# EAGLE design MFOS_VCO_edge (EAGLE 7.6.0)
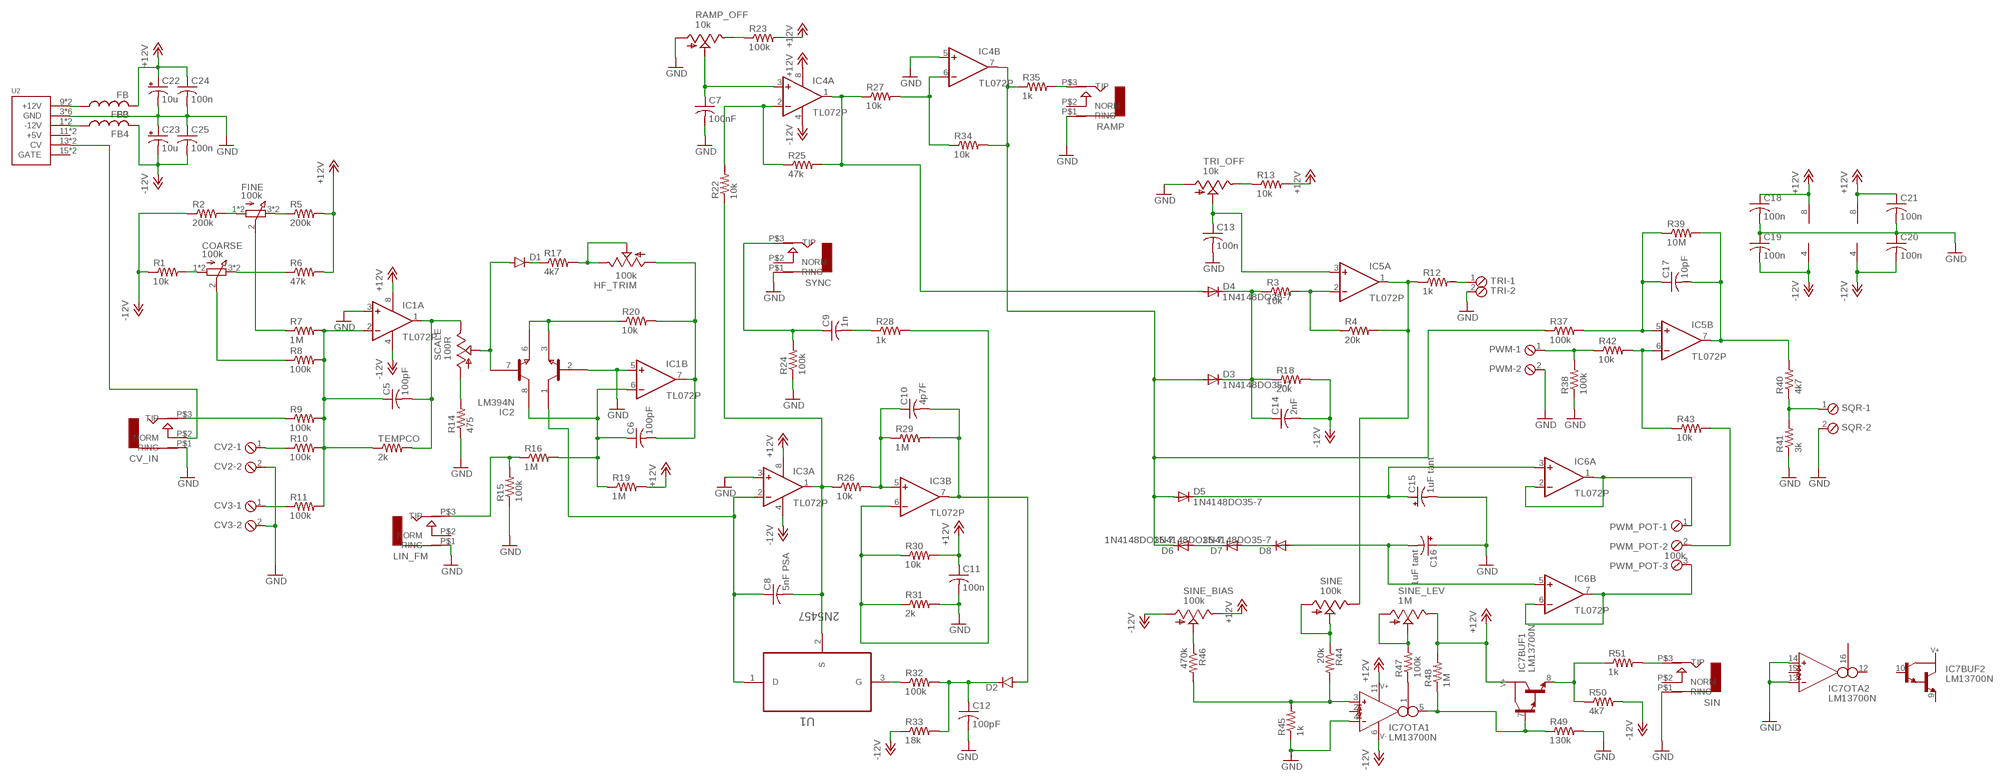
[diagram p0: schematic, sheet 1]

## Parts
C5  100pF  C-US050-024X044  [C050-024X044]
C6  100pF  C-US050-024X044  [C050-024X044]
C7  100nF  C-US050-024X044  [C050-024X044]
C8  5nF PSA  C-US050-024X044  [C050-024X044]
C9  1n  C-US050-024X044  [C050-024X044]
C10  4p7F  C-US050-024X044  [C050-024X044]
C11  100n  C-US050-024X044  [C050-024X044]
C12  100pF  C-US050-024X044  [C050-024X044]
C13  100n  C-US050-030X075  [C050-030X075]
C14  2nF  C-US050-030X075  [C050-030X075]
C15  1uF tant  CPOL-USB45181A  [B45181A]
C16  1uF tant  CPOL-USB45181A  [B45181A]
C17  10pF  C-US050-024X044  [C050-024X044]
C18  100n  C-USC1206  [C1206]
C19  100n  C-USC1206  [C1206]
C20  100n  C-USC1206  [C1206]
C21  100n  C-USC1206  [C1206]
C22  10u  CPOL-USB45181A  [B45181A]
C23  10u  CPOL-USB45181A  [B45181A]
C24  100n  C-US050-024X044  [C050-024X044]
C25  100n  C-US050-024X044  [C050-024X044]
COARSE  100k  3RP/1610N  [3RP/1610N]
CV2  MPT2  [2POL254]
CV3  MPT2  [2POL254]
CV_IN  AUDIO-JACKITEAD  [JACK-90DEG-ITEAD]
D1  DIODE1N4148  [DIODE-1N4148]
D2  DIODE1N4148  [DIODE-1N4148]
D3  1N4148DO35-7  [DO35-7]
D4  1N4148DO35-7  [DO35-7]
D5  1N4148DO35-7  [DO35-7]
D6  1N4148DO35-7  [DO35-7]
D7  1N4148DO35-7  [DO35-7]
D8  1N4148DO35-7  [DO35-7]
FB3  FB  [FB]
FB4  FB  [FB]
FINE  100k  3RP/1610N  [3RP/1610N]
HF_TRIM  100k  TRIM_US-B64W  [B64W]
IC1  TL072P  [DIL08]
IC2  LM394N  [DIL08]
IC3  TL072P  [DIL08]
IC4  TL072P  [DIL08]
IC5  TL072P  [DIL08]
IC6  TL072P  [DIL08]
IC7  LM13700N  [DIL16]
LIN_FM  AUDIO-JACKITEAD  [JACK-90DEG-ITEAD]
PWM  MPT2  [2POL254]
PWM_POT  100k  MPT3  [3POL254]
R1  10k  R-US_0207/7  [0207/7]
R2  200k  R-US_0207/7  [0207/7]
R3  10k  R-US_0207/7  [0207/7]
R4  20k  R-US_0207/7  [0207/7]
R5  200k  R-US_0207/7  [0207/7]
R6  47k  R-US_0207/7  [0207/7]
R7  1M  R-US_0207/7  [0207/7]
R8  100k  R-US_0207/7  [0207/7]
R9  100k  R-US_0207/7  [0207/7]
R10  100k  R-US_0207/7  [0207/7]
R11  100k  R-US_0207/7  [0207/7]
R12  1k  R-US_0207/7  [0207/7]
R13  10k  R-US_0207/7  [0207/7]
R14  475  R-US_0207/7  [0207/7]
R15  100k  R-US_0207/7  [0207/7]
R16  1M  R-US_0207/7  [0207/7]
R17  4k7  R-US_0207/7  [0207/7]
R18  20k  R-US_0207/7  [0207/7]
R19  1M  R-US_0207/7  [0207/7]
R20  10k  R-US_0207/7  [0207/7]
R22  10k  R-US_0207/7  [0207/7]
R23  100k  R-US_0207/7  [0207/7]
R24  100k  R-US_0207/7  [0207/7]
R25  47k  R-US_0207/7  [0207/7]
R26  10k  R-US_0207/7  [0207/7]
R27  10k  R-US_0207/7  [0207/7]
R28  1k  R-US_0207/7  [0207/7]
R29  1M  R-US_0207/7  [0207/7]
R30  10k  R-US_0207/7  [0207/7]
R31  2k  R-US_0207/7  [0207/7]
R32  100k  R-US_0207/7  [0207/7]
R33  18k  R-US_0207/7  [0207/7]
R34  10k  R-US_0207/7  [0207/7]
R35  1k  R-US_0207/7  [0207/7]
R37  100k  R-US_0207/7  [0207/7]
R38  100k  R-US_0207/7  [0207/7]
R39  10M  R-US_0207/7  [0207/7]
R40  4k7  R-US_0207/7  [0207/7]
R41  3k  R-US_0207/7  [0207/7]
R42  10k  R-US_0207/7  [0207/7]
R43  10k  R-US_0207/7  [0207/7]
R44  20k  R-US_0207/7  [0207/7]
R45  1k  R-US_0207/7  [0207/7]
R46  470k  R-US_0207/7  [0207/7]
R47  100k  R-US_0207/7  [0207/7]
R48  1M  R-US_0207/7  [0207/7]
R49  130k  R-US_0207/7  [0207/7]
R50  4k7  R-US_0207/7  [0207/7]
R51  1k  R-US_0207/7  [0207/7]
RAMP  AUDIO-JACKITEAD  [JACK-90DEG-ITEAD]
RAMP_OFF  10k  TRIM_US-B64W  [B64W]
SCALE  100R  TRIM_US-B64W  [B64W]
SIN  AUDIO-JACKITEAD  [JACK-90DEG-ITEAD]
SINE  100k  TRIM_US-B64W  [B64W]
SINE_BIAS  100k  TRIM_US-B64W  [B64W]
SINE_LEV  1M  TRIM_US-B64W  [B64W]
SQR  MPT2  [2POL254]
SYNC  AUDIO-JACKITEAD  [JACK-90DEG-ITEAD]
TEMPCO  2k  R-US_0207/2V  [0207/2V]
TRI  MPT2  [2POL254]
TRI_OFF  10k  TRIM_US-B64W  [B64W]
U1  2N5457  [TO127P254X732-3]
U2  POWER  [POWER_16]

## Nets
+12V: C11.1 C18.1 C21.1 C22.+ C24.1 FB3.P$2 IC1.8(P:V+) IC3.8(P:V+) IC4.8(P:V+) IC5.8(P:V+) IC6.8(P:V+) IC7.11(SUPPLY:V+) R5.2 R6.2 R13.2 R19.2 R23.2 R30.2 R48.2 SINE_BIAS.E SINE_LEV.E
-12V: C14.2 C19.2 C20.2 C23.- C25.2 FB4.P$2 IC1.4(P:V-) IC3.4(P:V-) IC4.4(P:V-) IC5.4(P:V-) IC6.4(P:V-) IC7.6(SUPPLY:V-) R1.1 R2.1 R18.2 R33.1 R50.2 SINE_BIAS.A
GND: C7.2 C11.2 C12.2 C13.2 C15.- C16.+ C18.2 C19.1 C20.1 C21.2 C22.- C23.+ C24.2 C25.1 CV2.2 CV3.2 CV_IN.P$1(RING) IC1.3(A:+IN) IC1.5(B:+IN) IC2.2(B1) IC3.3(A:+IN) IC4.5(B:+IN) IC7.4(OTA1:IN_N) IC7.13(OTA2:IN_N) IC7.14(OTA2:IN_P) LIN_FM.P$1(RING) PWM.2 R14.1 R15.1 R24.1 R31.2 R38.1 R41.1 R45.1 R49.2 RAMP.P$1(RING) RAMP_OFF.A SIN.P$1(RING) SQR.2 SYNC.P$1(RING) TRI.2 TRI_OFF.A U2.3(GND) U2.4(GND) U2.5(GND) U2.6(GND) U2.7(GND) U2.8(GND)
N$1: COARSE.1(A) COARSE.4(A) R1.2
N$2: FINE.1(A) FINE.4(A) R2.2
N$3: FINE.3(E) FINE.6(E) R5.1
N$4: COARSE.3(E) COARSE.6(E) R6.1
N$5: FINE.2(S) R7.1
N$6: COARSE.2(S) R8.1
N$7: R14.2 SCALE.A
N$8: D1.A IC2.7(B2) SCALE.P$1(S) SCALE.S
N$9: C5.2 IC1.1(A:OUT) SCALE.E TEMPCO.2
N$10: C5.1 IC1.2(A:-IN) R7.2 R8.2 R9.2 R10.2 R11.2 TEMPCO.1
N$12: IC2.3(E1) IC2.6(E2) R20.1
N$13: CV_IN.P$2(NORM) U2.13(CV) U2.14(CV)
N$14: HF_TRIM.E HF_TRIM.P$1(S) HF_TRIM.S R17.2
N$15: D1.C R17.1
N$16: C6.2 HF_TRIM.A IC1.7(B:OUT) R20.2
N$17: CV_IN.P$3(TIP) R9.1
N$18: CV2.1 R10.1
N$19: CV3.1 R11.1
N$20: LIN_FM.P$3(TIP) R15.2 R16.1
N$21: C8.2 IC3.1(A:OUT) R22.1 R26.1 U1.2(S)
N$22: C10.1 IC3.5(B:+IN) R26.2 R29.1
N$23: C8.1 IC2.1(C1) IC3.2(A:-IN) U1.1(D)
N$24: C9.2 R28.1
N$25: C9.1 R24.2 SYNC.P$3(TIP)
N$26: IC3.6(B:-IN) R28.2 R30.1 R31.1
N$27: R23.1 RAMP_OFF.E
N$28: C7.1 IC4.3(A:+IN) RAMP_OFF.P$1(S) RAMP_OFF.S
N$29: R32.1 U1.3(G)
N$30: C10.2 D2.A IC3.7(B:OUT) R29.2
N$31: IC4.2(A:-IN) R22.2 R25.1
N$32: C12.1 D2.C R32.2 R33.2
N$33: D4.A IC4.1(A:OUT) R25.2 R27.1
N$34: IC4.6(B:-IN) R27.2 R34.1
N$35: D3.A D5.A D6.C IC4.7(B:OUT) R34.2 R35.1 R37.1
N$36: R35.2 RAMP.P$3(TIP)
N$40: C6.1 IC1.6(B:-IN) IC2.8(C2) R16.2 R19.1
N$41: FB3.P$1 U2.9(+12V) U2.10(+12V)
N$42: D6.A D7.C
N$43: D7.A D8.C
N$44: C14.1 D3.C D4.C R3.1 R18.1
N$45: IC5.2(A:-IN) R3.2 R4.1
N$46: IC5.1(A:OUT) R4.2 R12.1 SINE.E
N$47: R12.2 TRI.1
N$48: R13.1 TRI_OFF.E
N$49: C13.1 IC5.3(A:+IN) TRI_OFF.P$1(S) TRI_OFF.S
N$50: C16.- D8.A IC6.5(B:+IN)
N$51: C15.+ D5.C IC6.3(A:+IN)
N$52: IC6.1(A:OUT) IC6.2(A:-IN) PWM_POT.1
N$53: IC6.6(B:-IN) IC6.7(B:OUT) PWM_POT.3
N$54: PWM.1 R38.2 R42.1
N$55: C17.1 IC5.5(B:+IN) R37.2 R39.1
N$56: C17.2 IC5.7(B:OUT) R39.2 R40.2
N$57: R40.1 R41.2 SQR.1
N$58: IC5.6(B:-IN) R42.2 R43.1
N$59: PWM_POT.2 R43.2
N$60: R44.1 SINE.A SINE.P$1(S) SINE.S
N$61: IC7.3(OTA1:IN_P) R44.2 R45.2 R46.2
N$62: R46.1 SINE_BIAS.P$1(S) SINE_BIAS.S
N$63: IC7.1(OTA1:I_BIAS) R47.1
N$64: R47.2 SINE_LEV.A SINE_LEV.P$1(S) SINE_LEV.S
N$65: IC7.5(OTA1:OUT) IC7.7(BUF1:B) R48.1 R49.1
N$66: R51.2 SIN.P$3(TIP)
N$67: IC7.8(BUF1:E) R50.1 R51.1
N$68: FB4.P$1 U2.1(-12V) U2.2(-12V)
Unconnected: IC7.2(OTA1:I_DIODE) IC7.9(BUF2:E) IC7.10(BUF2:B) IC7.12(OTA2:OUT) IC7.15(OTA2:I_DIODE) IC7.16(OTA2:I_BIAS) LIN_FM.P$2(NORM) RAMP.P$2(NORM) SIN.P$2(NORM) SYNC.P$2(NORM) U2.11(+5V) U2.12(+5V) U2.15(GATE) U2.16(GATE)

## Library data of the parts
C5-C14 C17-C21 C24 C25 = rcl:C-US: CAPACITOR, American symbol
C15 C16 C22 C23 = rcl:CPOL-US: POLARIZED CAPACITOR, American symbol
COARSE FINE = pot:3RP/1610N: 16mm Potentiometer one level Source: http://www.alphapotentiometers.net/html/16mm_pot_2.html
CV2 CV3 PWM SQR TRI = con-phoenix-254:MPT2: PHOENIX CONNECTOR; OC_FARNELL: unknown; OC_NEWARK: unknown
CV_IN LIN_FM RAMP SIN SYNC = erthenvar:AUDIO-JACK: Switching Mono 3.5mm Audio Jack from Erthenvar.
D1 D2 = SparkFun-DiscreteSemi:DIODE: Diode These are standard reverse protection diodes and small signal diodes. SMA package can handle up to about 1A. SOD-323 can handle about 200mA. What the SOD-323 package when ordering, there are some mfgs out there that are 5-pin packages.
D3-D8 = diode:1N4148: DIODE high speed (Philips)
FB3 FB4 = adafruit:FB: Ferrite bead Digikey #P9821BK-ND
HF_TRIM RAMP_OFF SCALE SINE SINE_BIAS SINE_LEV TRI_OFF = pot:TRIM_US-: POTENTIOMETER
IC1 IC3-IC6 = linear:TL072: OP AMP
IC2 = synthdiy:LM394: National Dual TRANSISTOR
IC7 = ota:LM13700: Dual OTA with buffers
PWM_POT = con-phoenix-254:MPT3: PHOENIX CONNECTOR; OC_FARNELL: unknown; OC_NEWARK: unknown
R1-R20 R22-R35 R37-R51 TEMPCO = rcl:R-US_: RESISTOR, American symbol
U1 = Fairchild_By_element14_Batch_1:2N5457: Transistor; MPN: 2N5457; OC_FARNELL: 1653694; OC_NEWARK: 58K2809; PACKAGE: TO-92; SUPPLIER: Fairchild
U2 = eurorack:POWER

## Board
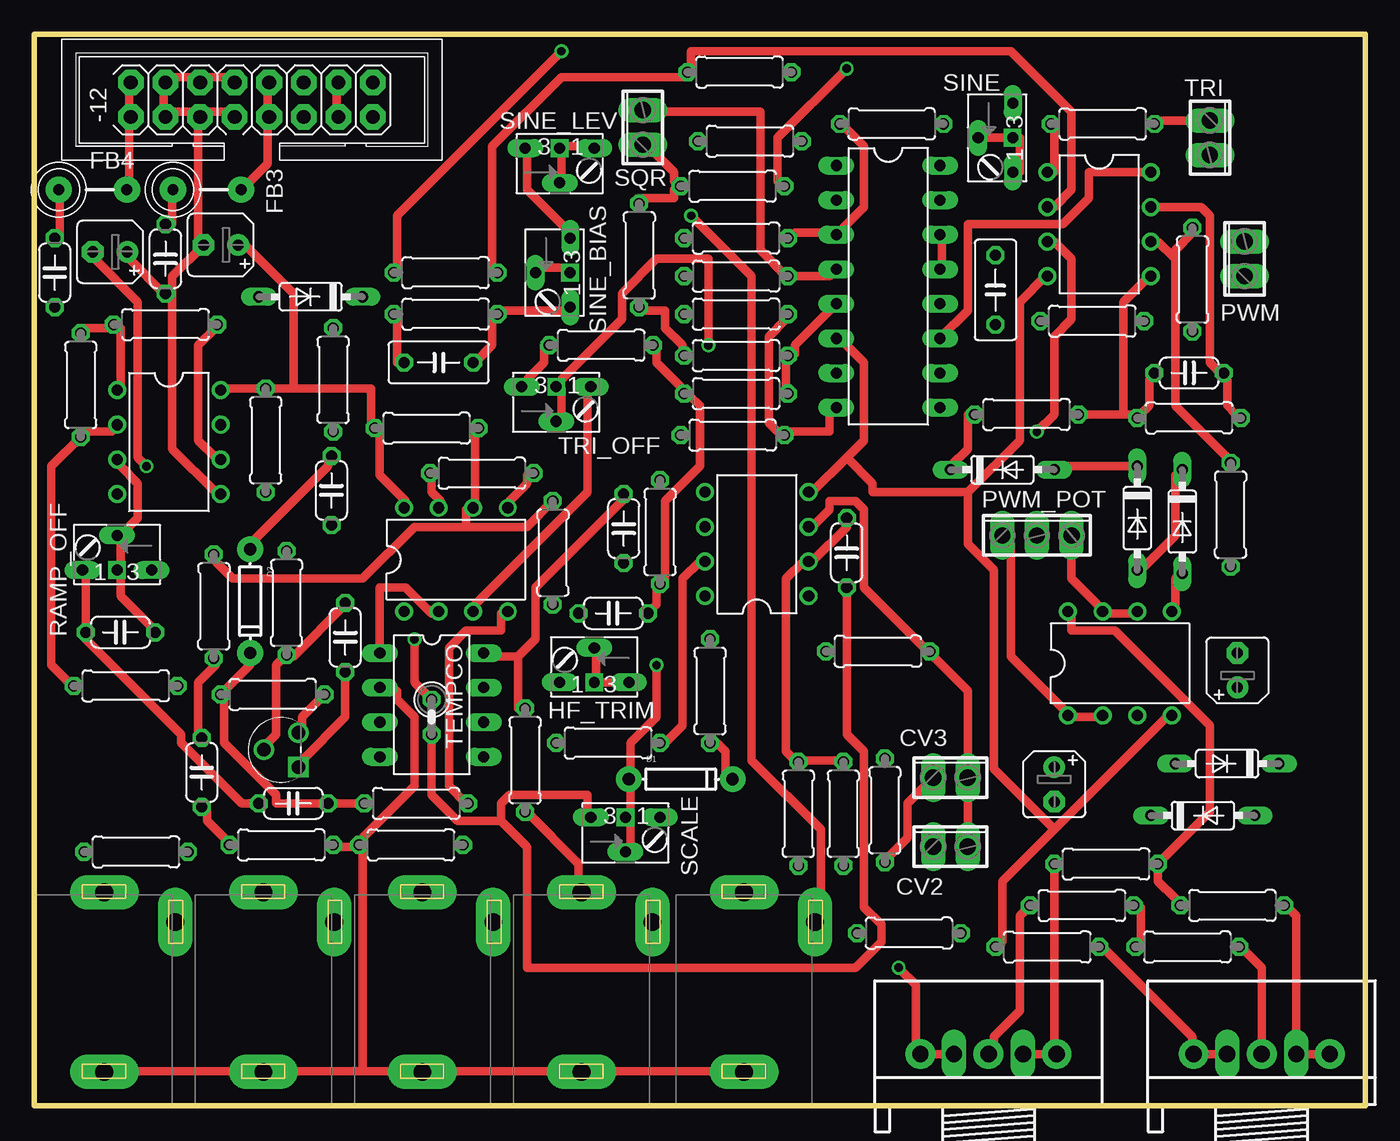
[diagram p1: board, top side]
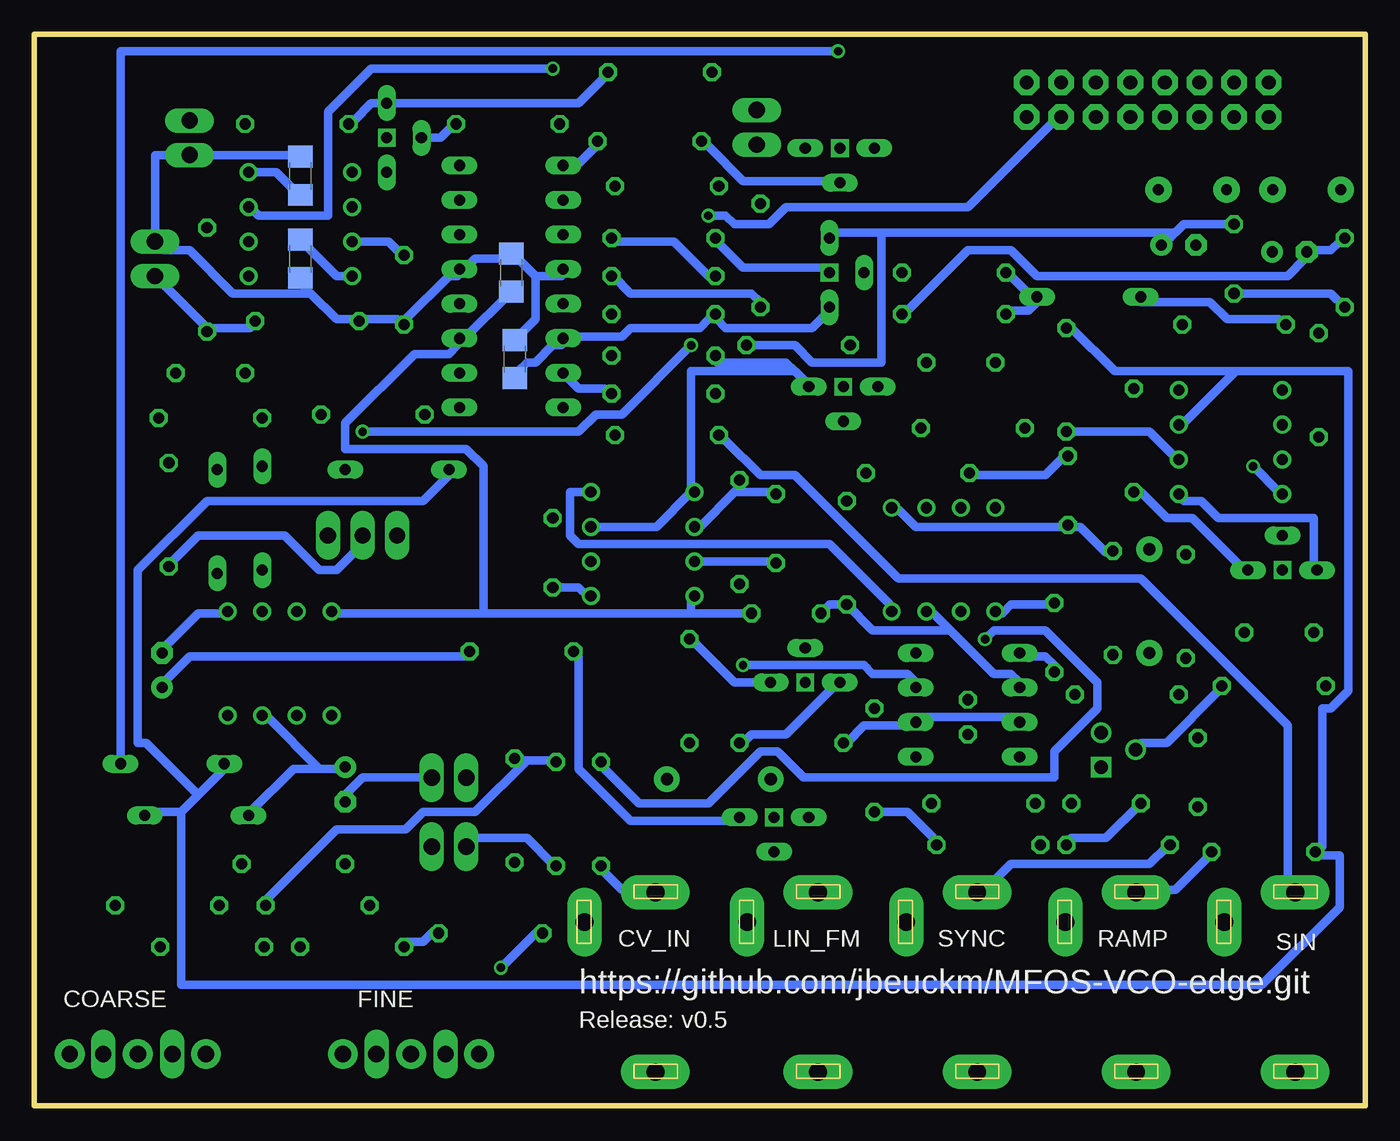
[diagram p2: board, bottom side, seen from below]

Size 97.79 x 78.74 mm. Coordinates in mm from the lower left corner, seen from the top.
Outline: 0,0 0,78.74 97.79,78.74 97.79,0 0,0
Copper layers (1*16): Top 0.035mm / dielectric 1.5mm / Bottom 0.035mm
Design rules "default *": minimum track width 24mil, minimum drill 24mil, track to track 12mil, track to pad 12mil, pad to pad 12mil, via to via 12mil, smd to smd 8mil, copper to edge 10mil, drill to drill 18mil, minimum pad ring 10mil, minimum via ring 8mil, stop-mask expansion 4mil, vias tented up to drill 0mil, thermal gap 10mil

### Footprints (pad centres in the part's own frame; a part is rotated, then mirrored left to right if it is on the bottom)
C050-024X044 = drill 0.813 octagon: 1 -2.54,0; 2 2.54,0
C050-030X075 = drill 0.813 octagon: 1 -2.54,0; 2 2.54,0
B45181A = drill 0.813 pad 1.6: + -1.27,0 | drill 0.813 pad 1.6 octagon: - 1.27,0
C1206 = smd 1.6 x 1.8: 1 -1.4,0; 2 1.4,0
3RP/1610N = drill 1.2 pad 2.184: 1 -5,0; 2 0,0; 3 5,0 | drill 1.2 long: 4 -2.54,0; 6 2.54,0
2POL254 = drill 1.2 long: 1 -1.27,0; 2 1.27,0
JACK-90DEG-ITEAD = drill 1.3 pad 2.54 long: P$1 5,-2.5; P$2 -0.2,-13.5; P$3 5,-15.7
DIODE-1N4148 = drill 0.9 pad 1.88: A -3.81,0; C 3.81,0
DO35-7 = drill 0.813 long: A 3.81,0; C -3.81,0
FB = drill 0.8 pad 1.93: P$1 -2.5,0; P$2 2.5,0
B64W = drill 0.813 long: A 2.54,0; E -2.54,0; S 0,-2.54 | drill 0.8 square: P$1 0,0
DIL08 = drill 0.813 pad 1.27: 1 -3.81,-3.81; 2 -1.27,-3.81; 3 1.27,-3.81; 4 3.81,-3.81; 5 3.81,3.81; 6 1.27,3.81; 7 -1.27,3.81; 8 -3.81,3.81
DIL08' = drill 0.813 long: 1 -3.81,-3.81; 2 -1.27,-3.81; 3 1.27,-3.81; 4 3.81,-3.81; 5 3.81,3.81; 6 1.27,3.81; 7 -1.27,3.81; 8 -3.81,3.81
DIL16 = drill 0.813 long: 1 -8.89,-3.81; 2 -6.35,-3.81; 3 -3.81,-3.81; 4 -1.27,-3.81; 5 1.27,-3.81; 6 3.81,-3.81; 7 6.35,-3.81; 8 8.89,-3.81; 9 8.89,3.81; 10 6.35,3.81; 11 3.81,3.81; 12 1.27,3.81; 13 -1.27,3.81; 14 -3.81,3.81; 15 -6.35,3.81; 16 -8.89,3.81
3POL254 = drill 1.2 long: 1 -2.54,0; 2 0,0; 3 2.54,0
0207/7 = drill 0.813 octagon: 1 -3.81,0; 2 3.81,0
0207/2V = drill 0.813 octagon: 1 -1.27,0; 2 1.27,0
TO127P254X732-3 = drill 0.991 square: 1 -2.54,-2.54 | drill 0.991: 2 -1.27,0; 3 0,-2.54
POWER_16 = drill 1.016 pad 1.88 octagon: 1 -6.35,-1.27; 2 -6.35,1.27; 3 -3.81,-1.27; 4 -3.81,1.27; 5 -1.27,-1.27; 6 -1.27,1.27; 7 1.27,-1.27; 8 1.27,1.27; 9 3.81,-1.27; 10 3.81,1.27; 11 6.35,-1.27; 12 6.35,1.27; 13 8.89,-1.27; 14 8.89,1.27; 15 11.43,-1.27; 16 11.43,1.27

### Placement (x,y rotation side)
C5  59.69,40.64 270 top
C6  43.31,42.42 270 top
C7  6.35,34.8 180 top
C8  22.86,34.42 90 top
C9  12.32,24.51 90 top
C10  21.84,45.21 90 top
C11  42.55,36.2 180 top
C12  19.05,22.23 180 top
C13  70.61,59.94 270 top
C14  29.72,54.61 0 top
C15  74.93,23.62 270 top
C16  88.39,32 90 top
C17  84.84,53.85 0 top
C18  62.74,61.21 90 bottom
C19  62.48,54.86 270 bottom
C20  78.23,62.23 90 bottom
C21  78.23,68.33 90 bottom
C22  13.72,63.25 180 top
C23  5.59,62.74 180 top
C24  9.65,62.23 270 top
C25  1.52,61.21 90 top
COARSE  90.17,3.81 0 top
CV2  67.31,19.05 0 top
CV3  67.31,24.13 0 top
CV_IN  57.15,0 180 top
D1  47.5,24 0 top
D2  15.88,37.08 270 top
D3  87.63,25.15 180 top
D4  20.32,59.44 180 top
D5  85.85,21.34 0 top
D6  71.12,46.74 0 top
D7  81.03,43.18 270 top
D8  84.33,42.93 270 top
FB3  12.7,67.31 180 top
FB4  4.32,67.31 180 top
FINE  70.1,3.81 0 top
HF_TRIM  41.15,31.11 180 top
IC1  53.09,41.27 90 top
IC2  LM394N  [DIL08']  29.21,29.46 270 top
IC3  30.99,40.13 0 top
IC4  9.91,48.77 270 top
IC5  78.23,64.77 270 top
IC6  79.76,32.51 0 top
IC7  62.74,60.2 270 top
LIN_FM  45.21,0 180 top
PWM  88.9,62.23 90 top
PWM_POT  73.66,41.91 0 top
R1  74.42,11.68 0 top
R2  64.26,12.7 180 top
R3  30.23,61.21 0 top
R4  51.82,75.95 0 top
R5  78.74,17.78 0 top
R6  88.01,14.73 180 top
R7  76.96,14.73 0 top
R8  84.71,11.68 180 top
R9  56.13,21.46 90 top
R10  59.44,21.46 90 top
R11  62.48,21.72 90 top
R12  78.49,72.14 0 top
R13  41.66,55.88 0 top
R14  61.98,33.4 180 top
R15  27.69,19.18 0 top
R16  36.07,25.4 90 top
R17  49.66,30.48 90 top
R18  30.23,58.17 0 top
R19  45.97,42.16 270 top
R20  42.16,26.67 0 top
R22  6.73,30.86 180 top
R23  17.02,48.9 90 top
R24  18.16,19.18 180 top
R25  3.43,52.96 90 top
R26  18.54,36.96 90 top
R27  9.65,57.4 0 top
R28  13.21,36.7 90 top
R29  32.89,46.48 180 top
R30  28.83,49.78 180 top
R31  38.1,40.64 270 top
R32  17.53,30.23 180 top
R33  28.07,22.23 180 top
R34  21.97,53.34 90 top
R35  7.49,18.67 0 top
R37  72.9,50.8 0 top
R38  77.72,57.66 0 top
R39  84.84,50.55 0 top
R40  51.31,67.56 0 top
R41  44.45,62.48 90 top
R42  85.09,60.71 90 top
R43  87.88,43.43 270 top
R44  62.99,72.14 180 top
R45  51.56,60.96 180 top
R46  51.56,63.75 0 top
R47  52.58,70.87 180 top
R48  51.56,52.32 180 top
R49  51.56,55.12 180 top
R50  51.56,58.17 180 top
R51  51.31,49.28 180 top
RAMP  21.84,0 180 top
RAMP_OFF  6.1,39.37 180 top
SCALE  43.43,21.21 0 top
SIN  10.16,0 180 top
SINE  71.88,71.12 270 top
SINE_BIAS  39.37,61.21 270 top
SINE_LEV  38.61,70.36 0 top
SQR  44.7,71.88 90 top
SYNC  33.53,0 180 top
TEMPCO  29.21,28.57 270 top
TRI  86.36,71.12 270 top
TRI_OFF  38.35,52.83 0 top
U1  16.89,27.43 90 top
U2  13.46,73.91 0 top

### Tracks (layer width: path | path; a pad name or v marks a point on that pad's centre or on a via)
+12V
  Top 0.61: IC4.8 13.97,52.7 R23.2 19.05,52.7 | IC3.8 27.3,44.45 25.4,46.35 25.4,49.53 R30.2 24.77,50.16 24.77,52.7 19.05,52.7 | SINE_LEV.E 36.2,69.85 36.2,67.31 39.37,64.14 SINE_BIAS.E | C24.1 10.16,64.77 10.16,67.31 FB3.P$2 | 19.05,52.7 19.05,59.69 15.24,63.5 C22.+ | IC5.8 77.47,68.58 77.47,66.67 75.56,64.77 68.58,64.77 68.58,58.42 IC7.11 | R13.2 45.72,55.88 45.72,54.61 47.62,52.7 R48.2 48.26,52.07 48.9,51.44 48.9,46.99 46.35,44.45 46.35,38.73 R19.2 45.72,38.1 45.72,36.83 C11.1 | R6.2 83.82,15.24 82.55,16.51 R5.2 86.36,21.59 86.36,27.94 79.38,34.92 76.2,34.92 76.2,36.2 IC6.8
  Bottom 0.61: 13.97,64.14 13.34,64.77 C24.1 | 13.97,64.14 14.61,63.5 C22.+ | 13.97,64.14 35.56,64.14 | 35.56,64.14 39.37,64.14 SINE_BIAS.E | IC5.8 80.01,68.58 78.74,67.31 C21.1 | C18.1 62.87,59.69 66.04,56.52 IC7.11 66.67,55.88 67.31,55.24 69.85,55.24 74.93,50.16 74.93,48.26 66.04,48.26 64.77,46.99 64.77,36.2 | C11.1 49.53,36.2 | 49.53,36.2 64.77,36.2 | 64.77,36.2 75.56,36.2 IC6.8 | 49.53,36.2 49.53,37.47 IC1.8 | 35.56,64.14 35.56,54.61 40.64,54.61 41.91,55.88 R13.2
-12V  (via drill 0.61)
  Top 0.61: 74.93,20.32 71.12,16.51 71.12,12.06 R1.1 | 74.93,20.32 83.19,28.57 IC6.4 | v8.26,46.99 7.62,47.62 7.62,59.05 4.45,62.23 C23.- | FB4.P$2 1.91,67.31 1.91,64.14 C25.2 | C14.2 32.38,54.61 33.66,55.88 33.66,57.78 R18.2 34.29,58.42 39.37,58.42 SINE_BIAS.A | R33.1 31.75,22.23 30.48,23.5 30.48,33.66 31.75,34.92 34.29,34.92 34.29,36.2 IC3.4 | 59.69,47.62 60.96,48.9 60.96,54.61 59.05,56.52 IC7.6 | 59.69,47.62 57.15,45.09 IC1.4 | 68.58,45.09 72.39,48.9 72.39,59.05 74.3,60.96 IC5.4 | 68.58,45.09 61.59,45.09 61.59,45.72 59.69,47.62 | 74.93,20.32 70.48,24.77 70.48,39.37 68.58,41.27 68.58,45.09
  Bottom 0.61: R2.1 68.58,12.7 69.22,12.06 70.48,12.06 R1.1 | v8.26,46.99 6.35,45.09 IC4.4 | C25.2 1.91,63.5 2.54,62.87 3.81,62.87 C23.- 4.45,62.23 5.71,60.96 24.13,60.96 26.04,62.87 29.21,62.87 33.66,58.42 R18.2 | SINE_BIAS.A 39.37,58.42 40.64,57.15 46.99,57.15 47.62,57.78 R50.2 48.26,57.78 48.9,57.15 53.98,57.15 54.61,56.52 58.42,56.52 IC7.6 59.05,55.88 59.69,55.88 60.96,54.61 61.59,54.61 62.23,53.98 C19.2 | IC5.4 75.56,60.96 78.11,63.5 C20.2 | IC1.4 58.42,45.09 58.42,41.91 57.78,41.27 39.37,41.27 34.92,36.83 IC3.4
GND
  Top 0.61: IC7.13 66.67,61.59 66.67,63.5 IC7.14 | IC7.4 58.42,60.96 R45.1 55.24,60.96 53.34,62.87 53.34,73.03 45.09,73.03 SQR.2 | CV2.2 CV3.2 68.58,30.48 66.04,33.02 R14.1 65.41,33.66 60.96,38.1 60.96,43.81 60.33,44.45 58.42,44.45 58.42,43.81 57.15,42.55 IC1.3 | R41.1 44.45,58.42 46.35,58.42 46.35,57.15 47.62,55.88 47.62,55.24 R49.2 | IC3.3 32.38,36.83 40.64,45.09 40.64,52.7 TRI_OFF.A | U2.5 12.06,73.03 10.16,73.03 U2.3 9.53,73.03 9.53,74.93 U2.4 10.16,75.56 12.06,75.56 U2.6 12.7,75.56 14.61,75.56 U2.8 | U2.7 14.61,73.03 12.7,73.03 U2.5 | RAMP_OFF.A 3.81,39.37 C7.2 3.81,34.29 10.79,27.3 10.79,26.67 15.24,22.23 C12.2 | 10.16,59.69 10.16,48.26 13.34,45.09 IC4.5 | C23.+ 6.99,62.23 9.53,59.69 C24.2 10.16,59.69 | 10.16,59.69 10.16,60.96 C22.- 12.06,63.5 12.06,72.39 U2.5 | CV_IN.P$1 52.07,2.54 40.64,2.54 LIN_FM.P$1 40.01,2.54 28.57,2.54 SYNC.P$1 27.94,2.54 24.13,2.54 | R24.1 22.23,19.05 23.5,19.05 R15.1 | SIN.P$1 5.71,2.54 16.51,2.54 RAMP.P$1 17.14,2.54 24.13,2.54 | 24.13,2.54 24.13,19.05 R15.1 | IC2.2 25.4,30.48 26.67,30.48 26.67,29.84 27.94,28.57 27.94,23.5 24.13,19.68 R15.1
  Bottom 0.61: C21.2 78.74,69.85 TRI.2 88.9,69.85 PWM.2 88.27,62.87 86.36,62.87 83.19,59.69 77.47,59.69 | 77.47,59.69 75.56,57.78 74.3,57.78 R38.1 73.66,57.78 71.12,57.78 C13.2 70.48,57.78 67.31,60.96 66.67,60.96 IC7.13 66.04,61.59 65.41,62.23 62.87,62.23 C18.2 62.23,62.23 60.96,60.96 | 77.47,59.69 78.11,60.33 C20.1 | 60.96,60.96 60.96,57.78 62.23,56.52 C19.1 | 60.96,60.96 59.05,60.96 IC7.4 | CV3.2 73.66,24.13 74.93,22.86 C15.- | C16.+ 88.27,31.11 86.36,33.02 66.04,33.02 R14.1 | C11.2 39.37,36.83 R31.2 36.2,34.92 30.48,34.92 | 30.48,34.92 31.75,36.2 IC3.3 | 30.48,34.92 27.3,31.75 26.04,31.75 25.4,31.11 IC2.2 | 49.53,45.09 52.07,42.55 IC1.3 | 41.91,53.98 42.55,54.61 47.62,54.61 R49.2 | 41.91,53.98 41.27,53.34 TRI_OFF.A | 49.53,45.09 49.53,53.98 41.91,53.98 | 49.53,45.09 IC1.5 | R45.1 55.24,60.96 53.98,59.69 45.09,59.69 44.45,59.05 R41.1 | C25.1 2.54,59.69 C24.2 | RAMP_OFF.A 3.81,39.37 3.81,43.18 10.79,43.18 12.06,44.45 13.34,44.45 IC4.5 | C12.2 19.05,19.68 21.59,19.68 R24.1
N$1
  Top 0.61: R1.2 78.74,11.43 85.09,5.08 85.09,3.81 COARSE.1 COARSE.4
N$2  (via drill 0.61)
  Top 0.61: v63.5,10.16 64.77,8.89 64.77,3.81 FINE.1 FINE.4
  Bottom 0.61: v63.5,10.16 60.96,12.7 R2.2
N$3
  Top 0.61: 74.93,3.81 R5.1 | 74.93,3.81 FINE.6 | 74.93,3.81 FINE.3
N$4
  Top 0.61: R6.1 92.08,14.61 92.71,13.97 COARSE.6 COARSE.3
N$5
  Top 0.61: R7.1 72.39,13.97 72.39,6.99 70.48,5.08 70.48,3.81 FINE.2
N$6
  Top 0.61: COARSE.2 90.17,10.16 88.9,11.43 R8.1
N$7
  Bottom 0.61: SCALE.A 46.35,20.95 53.98,20.95 57.78,24.77 57.78,33.02 R14.2
N$8  (via drill 0.61)
  Top 0.61: v45.72,32.38 45.72,28.57 43.81,26.67 43.81,24.13 D1.A 43.81,23.5 43.81,21.59 SCALE.P$1 43.81,20.95 43.81,19.05 SCALE.S
  Bottom 0.61: v45.72,32.38 36.83,32.38 36.2,31.75 33.66,31.75 33.02,31.11 IC2.7
N$9
  Top 0.61: TEMPCO.2 29.21,22.86 31.11,20.95 34.29,20.95 | 34.29,20.95 34.29,22.23 34.92,22.86 40.64,22.86 40.64,21.59 SCALE.E | C5.2 59.69,27.3 60.96,26.04 60.96,14.61 62.23,13.34 62.23,12.06 60.33,10.16 36.2,10.16 36.2,19.05 34.29,20.95
  Bottom 0.61: C5.2 57.78,38.1 57.15,37.47 IC1.1
N$10  (via drill 0.61)
  Top 0.61: R7.2 81.28,14.61 81.28,12.06 R8.2 | C5.1 59.69,42.55 57.15,40.01 IC1.2 56.52,40.01 55.24,38.73 55.24,26.04 55.88,25.4 R9.2 56.52,25.4 59.05,25.4 R10.2 | TEMPCO.1 27.94,31.11 v27.94,34.29
  Bottom 0.61: 61.59,25.4 62.23,25.4 R11.2 | 61.59,25.4 59.69,25.4 R10.2 | 61.59,25.4 65.41,21.59 69.22,21.59 70.48,20.32 75.56,20.32 80.64,15.24 R7.2 | v27.94,34.29 27.3,34.92 23.5,34.92 19.68,31.11 19.68,29.21 22.86,26.04 22.86,24.13 41.27,24.13 43.18,26.04 44.45,26.04 48.26,22.23 53.34,22.23 55.88,24.77 R9.2
N$12
  Bottom 0.61: IC2.3 25.4,28.57 33.02,28.57 IC2.6 33.02,27.94 36.83,27.94 38.1,26.67 R20.1
N$13  (via drill 0.61)
  Top 0.61: U2.13 22.23,73.03 22.23,74.93 U2.14 | v48.26,65.41 52.7,60.96 52.7,25.4 57.78,20.32 57.78,13.97 CV_IN.P$2
  Bottom 0.61: v48.26,65.41 46.99,65.41 46.35,64.77 43.81,64.77 42.55,66.04 29.21,66.04 22.86,72.39 U2.13
N$14
  Top 0.61: HF_TRIM.E 41.27,31.11 | 41.27,31.11 41.27,33.66 HF_TRIM.S | 41.27,31.11 HF_TRIM.P$1
  Bottom 0.61: HF_TRIM.E 46.35,31.11 49.53,34.29 R17.2
N$15
  Top 0.61: R17.1 50.16,26.67 50.8,26.04 50.8,24.13 D1.C
N$16
  Top 0.61: IC1.7 48.9,40.01 47.62,38.73 47.62,27.94 46.35,26.67 R20.2
  Bottom 0.61: IC1.7 43.81,40.01 C6.2 | HF_TRIM.A 38.73,31.11 42.55,27.3 45.09,27.3 45.72,26.67 R20.2
N$17
  Bottom 0.61: R9.1 55.88,17.14 54.61,15.88 52.7,15.88 CV_IN.P$3
N$18
  Bottom 0.61: CV2.1 65.41,19.68 61.59,19.68 59.69,17.78 R10.1
N$19
  Top 0.61: CV3.1 64.14,22.23 64.14,19.68 62.87,18.41 R11.1
N$20
  Top 0.61: R16.1 36.2,21.59 40.01,17.78 40.01,15.88 LIN_FM.P$3
  Bottom 0.61: R16.1 33.66,21.59 31.75,19.68 R15.2
N$21
  Top 0.61: C8.2 22.86,36.83 19.05,33.02 R26.1 17.78,32.38 17.78,27.3 17.14,26.67 U1.2
  Bottom 0.61: R22.1 10.79,30.48 14.61,26.67 16.51,26.67 U1.2 | IC3.1 26.67,36.2 26.04,36.83 22.86,36.83 C8.2
N$22
  Top 0.61: IC3.5 34.92,44.45 36.2,45.72 36.2,46.35 R29.1
  Bottom 0.61: R26.2 19.05,40.64 20.95,42.55 21.59,42.55 C10.1 22.23,42.55 33.02,42.55 34.29,43.81 IC3.5
N$23
  Top 0.61: IC2.1 25.4,38.1 27.3,38.1 29.21,36.2 IC3.2 | C8.1 22.86,28.57 19.68,25.4 U1.1
  Bottom 0.61: C8.1 22.86,32.38 23.5,33.02 25.4,33.02 IC2.1
N$24
  Top 0.61: C9.2 12.06,27.3 12.06,31.11 13.34,32.38 R28.1
N$25
  Top 0.61: R24.2 13.97,19.68 12.7,20.95 12.7,21.59 C9.1
  Bottom 0.61: R24.2 14.61,19.05 15.88,17.78 26.04,17.78 27.94,15.88 SYNC.P$3
N$26
  Top 0.61: 31.75,42.55 27.94,42.55 24.13,38.73 14.61,38.73 13.34,40.01 R28.2 | 31.75,42.55 31.75,43.81 IC3.6 32.38,44.45 32.38,49.53 R30.1 | R31.1 36.2,42.55 31.75,42.55
N$27
  Bottom 0.61: RAMP_OFF.E 8.89,39.37 12.7,43.18 14.61,43.18 16.51,45.09 R23.1
N$28
  Top 0.61: 6.35,41.91 6.35,39.37 | 6.35,41.91 7.62,43.18 7.62,45.72 6.35,46.99 IC4.3 | 6.35,41.91 RAMP_OFF.S | 6.35,39.37 6.35,37.47 8.89,34.92 C7.1 | 6.35,39.37 RAMP_OFF.P$1
N$29
  Top 0.61: R32.1 19.68,28.57 19.68,27.94 U1.3
N$30
  Top 0.61: IC3.7 29.84,44.45 29.21,45.09 29.21,46.35 R29.2 | D2.A 15.88,41.27 21.59,46.99 21.59,47.62 C10.2
  Bottom 0.61: C10.2 22.23,47.62 23.5,46.35 28.57,46.35 R29.2
N$31
  Top 0.61: R22.2 2.54,31.11 1.27,32.38 1.27,46.99 R25.1 3.81,49.53 5.71,49.53 IC4.2
N$32
  Top 0.61: R33.2 C12.1 17.78,22.23 17.78,22.86 13.97,26.67 13.97,29.84 R32.2 15.88,32.38 D2.C
N$33
  Top 0.61: IC4.1 6.35,52.7 6.35,57.15 R27.1 5.71,57.15 3.81,57.15 R25.2
  Bottom 0.61: D4.A 16.51,59.05 11.43,59.05 10.16,57.78 6.35,57.78 R27.1
N$34
  Top 0.61: R27.2 13.34,57.15 12.06,55.88 12.06,48.9 13.34,47.62 IC4.6
  Bottom 0.61: R34.1 15.88,49.53 13.97,47.62 IC4.6
N$35
  Top 0.61: D6.C 67.31,46.99 68.58,48.26 68.58,50.8 R37.1
  Bottom 0.61: 87,21.59 85.72,22.86 | 85.72,22.86 83.82,24.77 D3.A | 87,21.59 89.53,21.59 D5.A | 85.72,22.86 89.53,26.67 90.17,26.67 90.17,39.37 85.09,44.45 69.22,44.45 67.31,46.35 D6.C | 9.53,53.98 1.27,53.98 1.27,30.48 2.54,29.21 3.17,29.21 3.17,19.05 R35.1 3.17,18.41 1.91,18.41 1.91,14.61 7.62,8.89 87,8.89 87,21.59 | 9.53,53.98 13.34,50.16 IC4.7 | 9.53,53.98 18.41,53.98 21.59,57.15 R34.2
N$36
  Bottom 0.61: R35.2 11.43,18.41 13.97,15.88 16.51,15.88 RAMP.P$3
N$40
  Top 0.61: 35.56,33.02 33.02,33.02 IC2.8 | 35.56,33.02 35.56,29.21 R16.2 | 35.56,33.02 36.83,34.29 36.83,38.1 43.18,44.45 C6.1
  Bottom 0.61: 46.35,45.09 45.72,45.72 R19.1 | 46.35,45.09 48.9,42.55 IC1.6 | 46.35,45.09 43.81,45.09 C6.1
N$41
  Top 0.61: U2.10 17.14,74.93 17.14,73.03 U2.9 17.14,72.39 17.14,69.22 15.24,67.31 FB3.P$1
N$42
  Top 0.61: D7.C 74.93,46.99 D6.A
N$43
  Top 0.61: D7.A 81.28,39.37 83.82,41.91 83.82,46.35 D8.C
N$44  (via drill 0.61)
  Top 0.61: C14.1 26.67,54.61 26.67,57.78 R18.1 | v38.73,77.47 26.67,65.41 26.67,61.59 R3.1
  Bottom 0.61: R18.1 26.04,58.42 24.77,58.42 24.13,59.05 D4.C 24.13,59.69 24.77,59.69 26.04,60.96 R3.1 | D3.C 91.44,77.47 v38.73,77.47
N$45
  Top 0.61: R3.2 33.66,61.59 33.66,70.48 38.73,75.56 47.62,75.56 R4.1 48.26,76.2 48.26,77.47 71.75,77.47 76.2,73.03 76.2,67.31 74.93,66.04 IC5.2
N$46
  Top 0.61: IC5.1 74.93,68.58 74.93,71.75 R12.1
  Bottom 0.61: R4.2 55.88,75.56 57.78,73.66 SINE.E 73.03,73.66 74.3,72.39 R12.1
N$47
  Top 0.61: TRI.1 82.55,72.39 R12.2
N$48
  Top 0.61: TRI_OFF.E 36.2,53.34 37.47,54.61 37.47,55.88 R13.1
N$49  (via drill 0.61)
  Top 0.61: TRI_OFF.S 38.73,50.8 38.73,52.7 TRI_OFF.P$1 38.73,53.34 43.18,57.78 43.18,59.69 45.72,62.23 49.53,62.23 v49.53,55.88 | v73.66,49.53 74.93,50.8 74.93,56.52 76.2,57.78 76.2,62.23 74.93,63.5 IC5.3
  Bottom 0.61: IC5.3 71.75,63.5 71.12,62.87 C13.1 | v49.53,55.88 54.61,50.8 56.52,50.8 57.78,49.53 v73.66,49.53
N$50
  Top 0.61: IC6.5 83.82,36.83 83.82,38.73 D8.A
  Bottom 0.61: C16.- 88.27,33.66 85.72,36.2 83.82,36.2 IC6.5
N$51
  Bottom 0.61: 76.83,24.77 74.93,24.77 C15.+ | 76.83,24.77 78.74,24.77 81.92,21.59 D5.C | 76.83,24.77 80.64,28.57 IC6.3
N$52
  Top 0.61: IC6.2 78.11,28.57 76.2,28.57 IC6.1 75.56,29.21 71.75,33.02 71.75,41.27 PWM_POT.1
N$53
  Top 0.61: IC6.6 80.64,36.2 78.74,36.2 IC6.7 78.11,36.83 76.2,38.73 PWM_POT.3
N$54
  Bottom 0.61: 85.09,57.15 81.92,57.15 R38.2 | 85.09,57.15 PWM.1 | 85.09,57.15 R42.1
N$55
  Top 0.61: C17.1 81.92,53.34 81.92,51.44 R39.1 80.64,50.8 80.01,50.8 | 80.01,50.8 R37.2 | 80.01,50.8 80.01,59.05 81.92,60.96 IC5.5
N$56  (via drill 0.61)
  Top 0.61: R39.2 88.27,50.8 87.63,51.44 87.63,53.34 C17.2 87,53.98 86.36,54.61 86.36,65.41 85.72,66.04 IC5.7 | v59.69,76.2 54.61,71.12 54.61,67.94 R40.2
  Bottom 0.61: v59.69,76.2 73.03,76.2 76.2,73.03 76.2,65.41 81.28,65.41 81.92,66.04 IC5.7
N$57
  Top 0.61: R41.2 44.45,66.67 46.99,66.67 46.99,67.31 R40.1 46.99,67.94 46.99,68.58 45.09,70.48 SQR.1
N$58
  Top 0.61: 83.82,62.23 83.82,51.44 87.63,47.62 R43.1 | 83.82,62.23 82.55,63.5 IC5.6 | 83.82,62.23 83.82,62.87 85.09,64.14 R42.2
N$59
  Bottom 0.61: PWM_POT.2 73.66,41.27 75.56,39.37 76.83,39.37 79.38,41.91 85.72,41.91 87.63,40.01 R43.2
N$60
  Top 0.61: SINE.S SINE.P$1 72.39,71.12 72.39,68.58 SINE.A
  Bottom 0.61: SINE.S 67.94,71.12 67.31,71.75 R44.1
N$61
  Top 0.61: R46.2 55.88,64.14 58.42,64.14 IC7.3 60.96,66.04 60.96,70.48 59.69,71.75 R44.2
  Bottom 0.61: R45.2 48.26,60.96 50.8,63.5 55.24,63.5 R46.2
N$62
  Top 0.61: SINE_BIAS.P$1 39.37,61.59 36.83,61.59 SINE_BIAS.S
  Bottom 0.61: R46.1 47.62,63.5 45.72,61.59 39.37,61.59 SINE_BIAS.P$1
N$63
  Bottom 0.61: R47.1 56.52,70.48 57.78,69.22 58.42,69.22 IC7.1
N$64
  Top 0.61: SINE_LEV.A 40.64,70.48 38.73,70.48 SINE_LEV.P$1 38.73,69.85 38.73,67.94 SINE_LEV.S
  Bottom 0.61: R47.2 48.26,70.48 45.72,67.94 38.73,67.94 SINE_LEV.S
N$65
  Top 0.61: R48.1 55.24,52.7 55.24,54.61 R49.1 55.88,55.24 55.88,55.88 IC7.5
  Bottom 0.61: IC7.7 57.78,52.7 55.88,52.7 R48.1
N$66
  Bottom 0.61: R51.2 46.99,48.9 44.45,46.35 41.91,46.35 34.29,38.73 16.51,38.73 5.71,27.94 5.71,15.88 SIN.P$3
N$67
  Top 0.61: IC7.8 58.42,50.8 58.42,49.53 55.24,49.53 R51.1 54.61,49.53 53.98,50.16 53.98,56.52 55.24,57.78 R50.1
N$68
  Top 0.61: U2.2 6.99,74.93 6.99,73.03 U2.1 6.99,72.39 6.99,67.31 FB4.P$1

### Text on the board
bNames: https://github.com/jbeuckm/MFOS-VCO-edge.git | Release: v0.5